# EAGLE design LoRaLo_V20-1 (EAGLE 7.5.0)
RFM95W
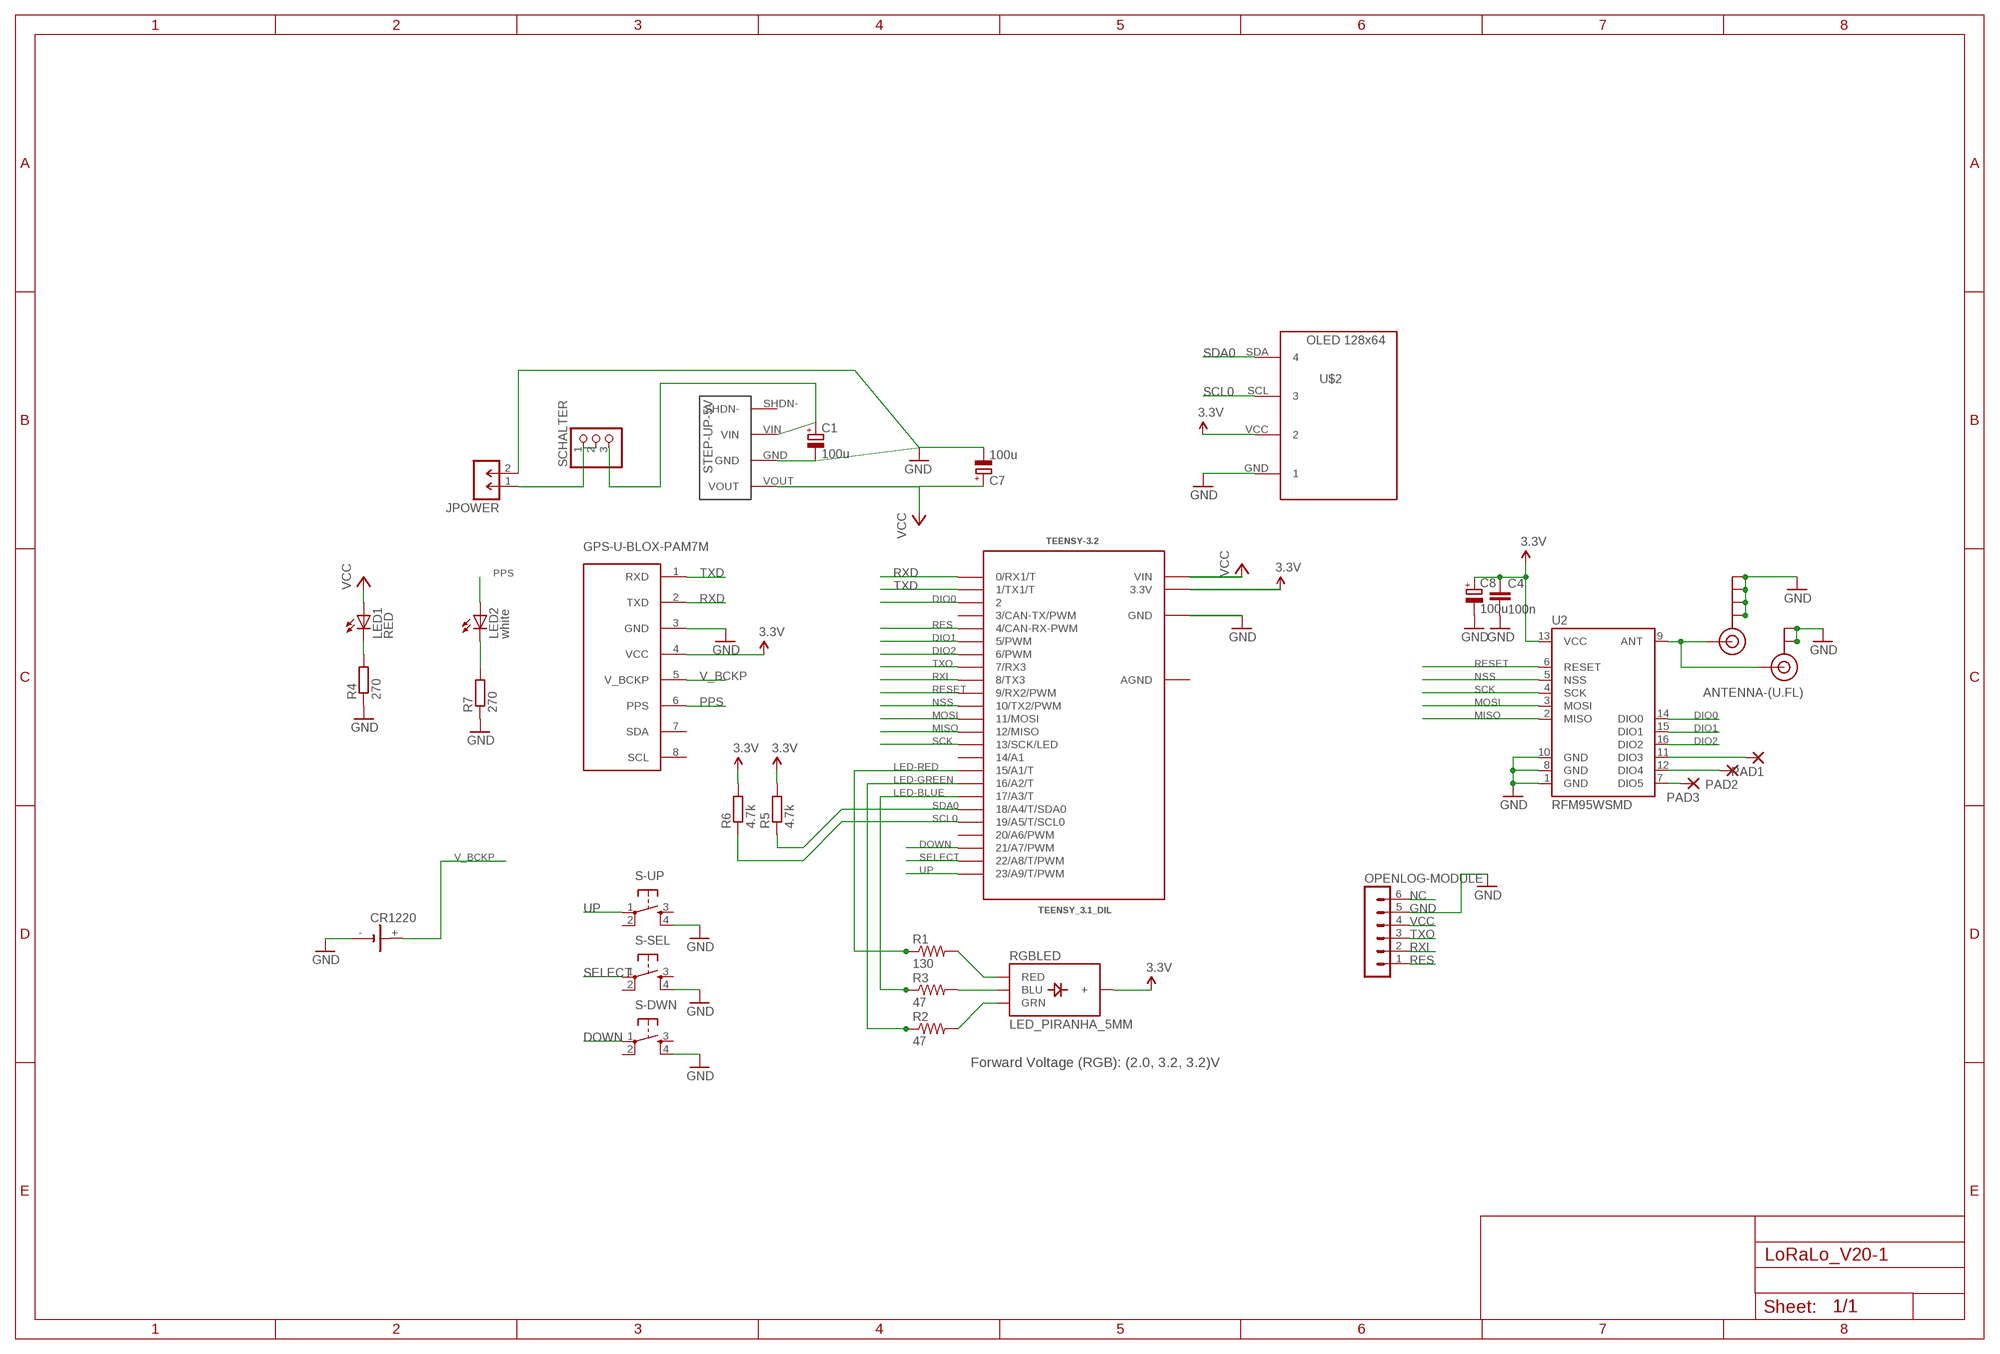
[diagram p0: schematic, sheet 1]

## Parts
ANTENNA-(EDGE-MOUNT)  SMA_EDGE  [SMA-EDGE]
ANTENNA-(U.FL)  U.FL  [U.FL]
C1  100u  CPOL-EUD  [PANASONIC_D]
C4  100n  C-EUC1206  [C1206]
C7  100u  CPOL-EUD  [PANASONIC_D]
C8  100u  CPOL-EUD  [PANASONIC_D]
CR1220  CH291-1220LF  [CH291-1220LF]
GPS-U-BLOX-PAM7M  U-BLOX-PAM-7Q  [U-BLOX-PAM-7Q]
JPOWER  M-1X02-SIP-100-40  [SIP-100-02-40]
LED1  RED  LED1206  [LED-1206]
LED2  white  LED1206  [LED-1206]
OPENLOG-MODULE  MA06-1  [MA06-1]
PAD1  1,6/0,8  [1,6/0,8]
PAD2  1,6/0,8  [1,6/0,8]
PAD3  1,6/0,8  [1,6/0,8]
R1  130  RESISTOR1206  [1206]
R2  47  RESISTOR1206  [1206]
R3  47  RESISTOR1206  [1206]
R4  270  R-EU_M1206  [M1206]
R5  4.7k  R-EU_M1206  [M1206]
R6  4.7k  R-EU_M1206  [M1206]
R7  270  R-EU_M1206  [M1206]
RGBLED  LED_PIRANHA_5MM  [LED_PIRANHA_5MM]
S-DWN  TAC_SWITCHPTH  [TACTILE-PTH]
S-SEL  TAC_SWITCHPTH  [TACTILE-PTH]
S-UP  TAC_SWITCHPTH  [TACTILE-PTH]
SCHALTER  PINHD-1X3  [1X03]
STEP-UP-5V  POLOLU_STEP-UP  [POLOLU_STEP-UP]
TEENSY-3.2  TEENSY_3.1_DIL  [TEENSY3-DIL]
U2  RFM95WSMD  [RFM95W_SMD]
U$2  OLED_128X64  [OLED_128X64]

## Nets
3.3V [power]: C4.1 C8.+ GPS-U-BLOX-PAM7M.4(VCC) R5.2 R6.2 RGBLED.+ TEENSY-3.2.3.3V U2.13(VCC) U$2.VCC
DIO0: TEENSY-3.2.2 U2.14(DIO0)
DIO1: TEENSY-3.2.5(5/PWM) U2.15(DIO1)
DIO2: TEENSY-3.2.6(6/PWM) U2.16(DIO2)
DOWN: S-DWN.1 TEENSY-3.2.21/A7(21/A7/PWM)
GND [power]: ANTENNA-(EDGE-MOUNT).GND@0(GND) ANTENNA-(EDGE-MOUNT).GND@1(GND) ANTENNA-(EDGE-MOUNT).GND@2(GND) ANTENNA-(EDGE-MOUNT).GND@3(GND) ANTENNA-(U.FL).P$1(GND) ANTENNA-(U.FL).P$2(GND) C1.- C4.2 C7.- C8.- CR1220.- GPS-U-BLOX-PAM7M.3(GND) JPOWER.2 OPENLOG-MODULE.5 R4.1 R7.1 S-DWN.4 S-SEL.4 S-UP.4 STEP-UP-5V.GND TEENSY-3.2.GND U2.1(GND) U2.8(GND) U2.10(GND) U$2.GND
LED-BLUE: R3.1 TEENSY-3.2.17/A3(17/A3/T)
LED-GREEN: R2.1 TEENSY-3.2.16/A2(16/A2/T)
LED-RED: R1.1 TEENSY-3.2.15/A1(15/A1/T)
MISO: TEENSY-3.2.12(12/MISO) U2.2(MISO)
MOSI: TEENSY-3.2.11(11/MOSI) U2.3(MOSI)
N$1: R1.2 RGBLED.R(RED)
N$2: PAD1.1(P) U2.11(DIO3)
N$3: R2.2 RGBLED.G(GRN)
N$4 [power]: C1.+ SCHALTER.3 STEP-UP-5V.VIN
N$5: ANTENNA-(EDGE-MOUNT).SIG(SIGNAL) ANTENNA-(U.FL).P$3(SIGNAL) U2.9(ANT)
N$6: PAD2.1(P) U2.12(DIO4)
N$7: PAD3.1(P) U2.7(DIO5)
N$9: R3.2 RGBLED.B(BLU)
N$10: JPOWER.1 SCHALTER.1 SCHALTER.2
N$11: LED2.C R7.2
N$23: LED1.C R4.2
NC: OPENLOG-MODULE.6
NSS: TEENSY-3.2.10(10/TX2/PWM) U2.5(NSS)
PPS: GPS-U-BLOX-PAM7M.6(PPS) LED2.A
RES: OPENLOG-MODULE.1 TEENSY-3.2.4(4/CAN-RX-PWM)
RESET: TEENSY-3.2.9(9/RX2/PWM) U2.6(RESET)
RXD: GPS-U-BLOX-PAM7M.2(TXD) TEENSY-3.2.0(0/RX1/T)
RXI: OPENLOG-MODULE.2 TEENSY-3.2.8(8/TX3)
SCK: TEENSY-3.2.13(13/SCK/LED) U2.4(SCK)
SCL0: R6.1 TEENSY-3.2.19/A5(19/A5/T/SCL0) U$2.SCL
SDA0: R5.1 TEENSY-3.2.18/A4(18/A4/T/SDA0) U$2.SDA
SELECT: S-SEL.1 TEENSY-3.2.22/A8(22/A8/T/PWM)
TXD: GPS-U-BLOX-PAM7M.1(RXD) TEENSY-3.2.1(1/TX1/T)
TXO: OPENLOG-MODULE.3 TEENSY-3.2.7(7/RX3)
UP: S-UP.1 TEENSY-3.2.23/A9(23/A9/T/PWM)
V_BCKP: CR1220.+ GPS-U-BLOX-PAM7M.5(V_BCKP)
VCC [power]: C7.+ LED1.A OPENLOG-MODULE.4 STEP-UP-5V.VOUT TEENSY-3.2.VIN
Unconnected: GPS-U-BLOX-PAM7M.7(SDA) GPS-U-BLOX-PAM7M.8(SCL) S-DWN.2 S-DWN.3 S-SEL.2 S-SEL.3 S-UP.2 S-UP.3 STEP-UP-5V.SHDN- TEENSY-3.2.3(3/CAN-TX/PWM) TEENSY-3.2.14/A0(14/A1) TEENSY-3.2.20/A6(20/A6/PWM)

## Notes on the sheet
- Forward Voltage (RGB): (2.0, 3.2, 3.2)V

## Power pins joined to a net without a drawn wire
AGND: TEENSY-3.2.AGND

## Library data of the parts
ANTENNA-(EDGE-MOUNT) = SparkFun-Connectors:SMA_EDGE: SMA Antenna Connector End launch SMA connector. The paste layer has been removed so that the connector can be hand soldered onto the board after reflow.
ANTENNA-(U.FL) = SparkFun-Connectors:U.FL: SMD antenna connector- WRL-09144; PROD_ID: CONN-09193
C1 C7 C8 = rcl:CPOL-EU: POLARIZED CAPACITOR, European symbol
C4 = resistor:C-EU: CAPACITOR, European symbol
CR1220 = battery_mod:CH291-1220LF: Battery Holder, SMT, 12mm multicomp PART NO. CH291-1220LF Source: Data sheet <http://www.farnell.com/datasheets/1505860.pdf>
GPS-U-BLOX-PAM7M = u-blox:U-BLOX-PAM-7Q
JPOWER = con-headers-jp:M-1X02-: MALE HEADER
LED1 LED2 = SparkFun-LED:LED: LEDs Standard schematic elements and footprints for 5mm, 3mm, 1206, and 0603 sized LEDs. 5mm - Spark Fun Electronics SKU : COM-00529 (and others)
OPENLOG-MODULE = con-lstb:MA06-1: PIN HEADER; OC_FARNELL: unknown; OC_NEWARK: unknown
PAD1-PAD3 = wirepad:1,6/0,8: THROUGH-HOLE PAD
R1-R3 = SparkFun-Passives:RESISTOR: Resistor Basic schematic elements and footprints for 0603, 1206, and PTH resistors.
R4-R7 = rcl:R-EU_: RESISTOR, European symbol
RGBLED = SparkFun-LED_mod:LED_PIRANHA_5MM: High-brightness RGB through-hole LED, similar to that used in the Shiftbrite
S-DWN S-SEL S-UP = SparkFun-Retired:TAC_SWITCH: Momentary Switch Button commonly used for reset or general input. Spark Fun Electronics SKU : COM-00097 SMT- SWCH-08247
SCHALTER = pinhead:PINHD-1X3: PIN HEADER
STEP-UP-5V = Pololu_Step-Up:POLOLU_STEP-UP
TEENSY-3.2 = Teensy_3_and_LC_Series_Boards_v1.1:TEENSY_3.1_DIL: Teensy 3.1 or 3.2 in a DIL Layout.
U2 = misiek:RFM95W
U$2 = OLED:OLED_128X64

## Net classes
0 default: width 0.12 mm
1 power: width 0.762 mm, drill 0.457 mm, clearance 0.457 mm

## Board
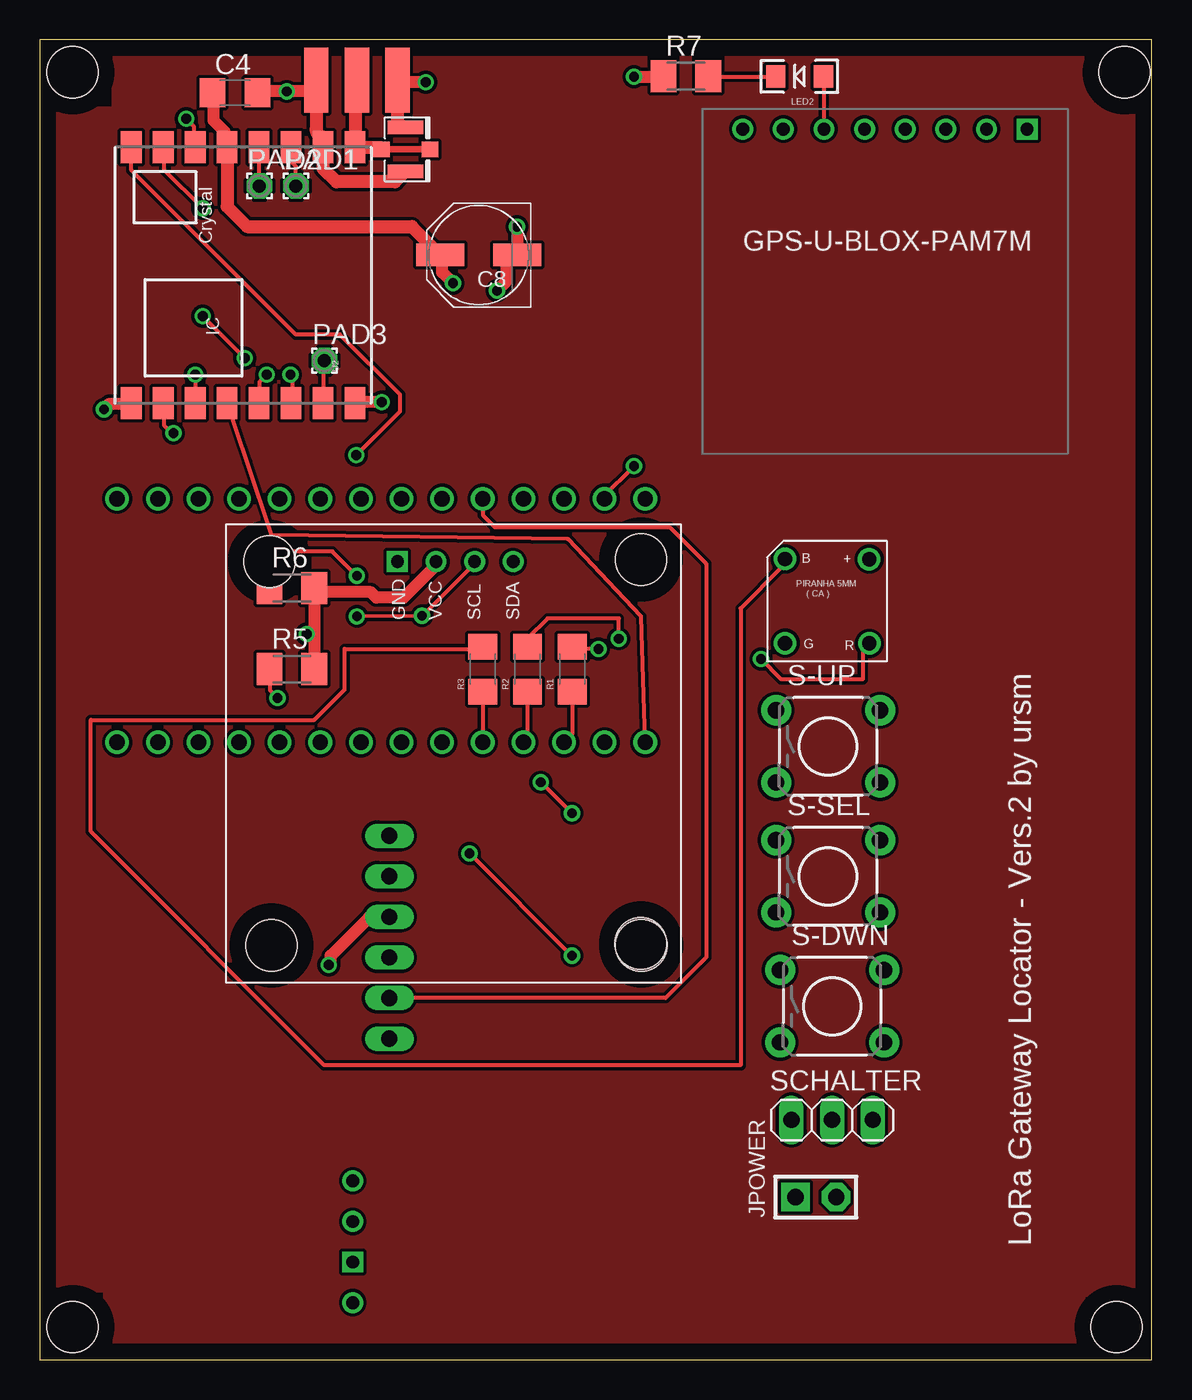
[diagram p1: board, top side]
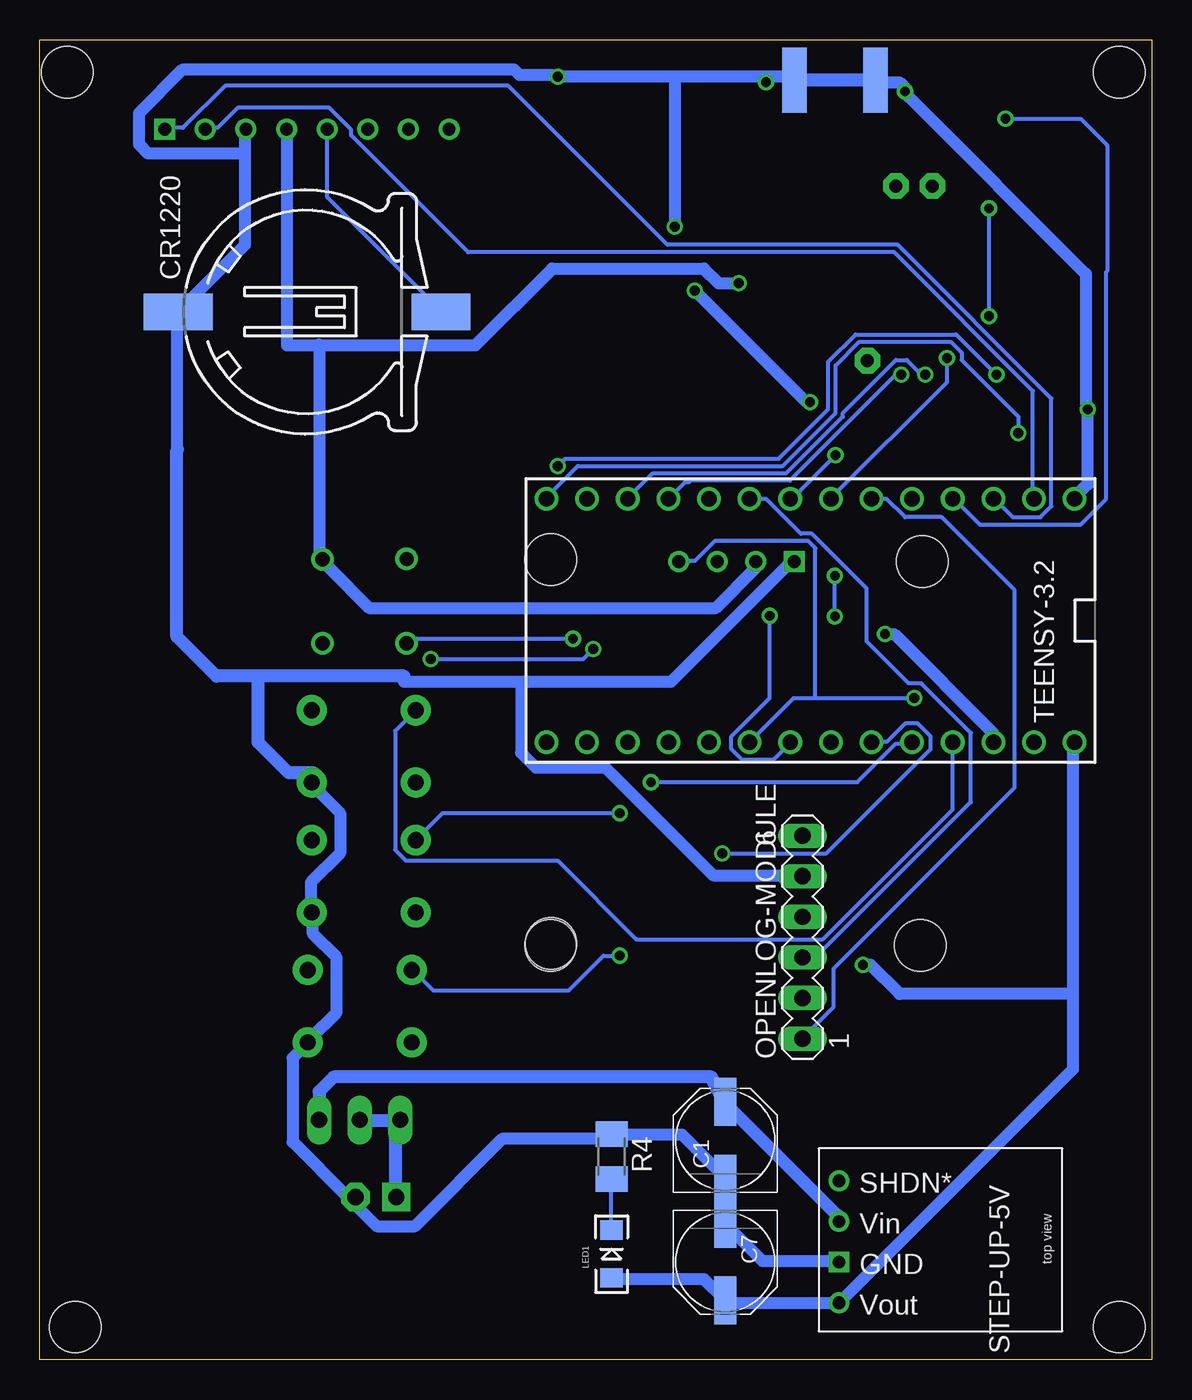
[diagram p2: board, bottom side, seen from below]

Size 69.52 x 82.54 mm. Coordinates in mm from the lower left corner, seen from the top.
Outline: 0,0 69.52,0 69.52,82.54 0,82.54 0,0
Copper layers (1*16): Top 0.035mm / dielectric 1.5mm / Bottom 0.035mm
Design rules "default": minimum track width 10mil, minimum drill 24mil, track to track 8mil, track to pad 8mil, pad to pad 8mil, via to via 8mil, smd to smd 8mil, copper to edge 40mil, drill to drill 8mil, minimum pad ring 10mil, minimum via ring 8mil, stop-mask expansion 4mil, vias tented up to drill 0mil, thermal gap 10mil
Holes 3.2 mm at 2.03,80.52 67.82,80.52 14.48,25.91 67.31,2.03 37.59,25.91 2.03,2.03

### Footprints (pad centres in the part's own frame; a part is rotated, then mirrored left to right if it is on the bottom)
SMA-EDGE = smd 1.524 x 4.064: GND@0 0,0; GND@1 5.08,0; SIG 2.54,0 | smd 1.524 x 4.064 bottom: GND@2 0,0; GND@3 5.08,0
U.FL = smd 2.2 x 0.85: P$1 0,1.375; P$2 0,-1.375 | smd 1.05 x 1: P$3 1.525,0; P$4 -1.525,0
PANASONIC_D = smd 3 x 1.4: + 2.4,0; - -2.4,0
C1206 = smd 1.6 x 1.8: 1 -1.4,0; 2 1.4,0
CH291-1220LF = smd 2.3 x 3.66: + 0,-2.296 | smd 2.3 x 4.3: - 0,14.146
U-BLOX-PAM-7Q = drill 0.8 square: 1 3.81,-2.54 | drill 0.8: 2 1.27,-2.54; 3 -1.27,-2.54; 4 -3.81,-2.54; 5 -6.35,-2.54; 6 -8.89,-2.54; 7 -11.43,-2.54; 8 -13.97,-2.54
SIP-100-02-40 = drill 1.016 pad 1.778 square: 1 -1.27,0 | drill 1.016 pad 1.778 octagon: 2 1.27,0
LED-1206 = smd 1.2 x 1.4: A -1.5,0; C 1.5,0
MA06-1 = drill 1.016 long: 1 -6.35,0; 2 -3.81,0; 3 -1.27,0; 4 1.27,0; 5 3.81,0; 6 6.35,0
1,6/0,8 = drill 0.813 pad 1.6 octagon: 1 0,0
1206 = smd 1.6 x 1.8: 1 -1.4,0; 2 1.4,0
M1206 = smd 1.6 x 2: 1 -1.4,0; 2 1.4,0
LED_PIRANHA_5MM = drill 0.9: + 2.575,2.562; B -2.688,2.574; G -2.684,-2.684; R 2.579,-2.696
TACTILE-PTH = drill 1.016 pad 1.88: 1 -3.251,2.261; 2 3.251,2.261; 3 -3.251,-2.261; 4 3.251,-2.261
1X03 = drill 1.016 long: 1 -2.54,0; 2 0,0; 3 2.54,0
POLOLU_STEP-UP = drill 0.8 square: GND 7.112,1.27 | drill 0.8: SHDN- 2.032,1.27; VIN 4.572,1.27; VOUT 9.652,1.27
TEENSY3-DIL = drill 0.965: 0 -7.62,13.97; 1 -7.62,11.43; 2 -7.62,8.89; 3 -7.62,6.35; 3.3V 7.62,11.43; 4 -7.62,3.81; 5 -7.62,1.27; 6 -7.62,-1.27; 7 -7.62,-3.81; 8 -7.62,-6.35; 9 -7.62,-8.89; 10 -7.62,-11.43; 11 -7.62,-13.97; 12 -7.62,-16.51; 13 7.62,-16.51; 14/A0 7.62,-13.97; 15/A1 7.62,-11.43; 16/A2 7.62,-8.89; 17/A3 7.62,-6.35; 18/A4 7.62,-3.81; 19/A5 7.62,-1.27; 20/A6 7.62,1.27; 21/A7 7.62,3.81; 22/A8 7.62,6.35; 23/A9 7.62,8.89; AGND 7.62,13.97; GND -7.62,16.51; VIN 7.62,16.51
RFM95W_SMD = smd 2 x 1.3: 1 -8,7; 2 -8,5; 3 -8,3; 4 -8,1; 5 -8,-1; 6 -8,-3; 7 -8,-5; 8 -8,-7; 9 8,-7; 10 8,-5; 11 8,-3; 12 8,-1; 13 8,1; 14 8,3; 15 8,5; 16 8,7
OLED_128X64 = drill 0.8 square: GND -1.778,10.541 | drill 0.8: SCL 3.044,10.54; SDA 5.455,10.541; VCC 0.633,10.541 | hole 3.2: -9.776,10.539; 13.444,10.666; 13.441,-13.345; -9.65,-13.473

### Placement (x,y rotation side)
ANTENNA-(EDGE-MOUNT)  17.27,80.01 0 top
ANTENNA-(U.FL)  22.86,75.69 0 top
C1  26.67,13.72 90 bottom
C4  12.19,79.25 0 top
C7  26.67,6.1 270 bottom
C8  27.43,69.09 180 top
CR1220  46.74,65.53 90 bottom
GPS-U-BLOX-PAM7M  57.91,79.5 0 top
JPOWER  48.51,10.16 0 top
LED1  33.78,6.6 90 bottom
LED2  47.5,80.26 180 top
OPENLOG-MODULE  21.84,26.42 90 bottom
PAD1  16,73.41 0 top
PAD2  13.72,73.41 0 top
PAD3  17.78,62.48 0 top
R1  33.27,43.18 90 top
R2  30.48,43.18 90 top
R3  27.69,43.18 90 top
R4  33.78,12.7 270 bottom
R5  15.75,43.18 0 top
R6  15.75,48.26 0 top
R7  40.39,80.26 0 top
RGBLED  49.28,47.5 0 top
S-DWN  49.53,22.1 0 top
S-SEL  49.28,30.23 0 top
S-UP  49.28,38.35 0 top
SCHALTER  49.53,14.99 0 top
STEP-UP-5V  20.83,13.21 270 bottom
TEENSY-3.2  21.34,46.23 270 bottom
U2  12.7,67.82 90 top
U$2  24.13,39.37 0 top

### Tracks (layer width: path | path; a pad name or v marks a point on that pad's centre or on a via)
3.3V  (via drill 0.61)
  Top 0.762: 17.14,45.38 17.14,48.23 R6.2 17.49,48.01 20.69,48.01 21.03,47.66 22.75,47.66 24.69,49.61 24.69,49.84 U$2.VCC | 17.14,45.38 17.14,43.2 R5.2 | v16.69,45.38 17.14,45.38 | C4.1 10.86,79.21 10.86,77.5 11.54,76.81 11.54,76.01 11.66,75.89 U2.13 | v25.83,67.32 25.15,68.01 25.15,69.04 C8.+
  Top 0.813: U2.13 11.7,72.12 12.95,70.87 23.25,70.87 C8.+
  Bottom 0.762: v16.69,45.38 16.12,45.38 9.94,39.2 9.94,38.63 TEENSY-3.2.3.3V | 24.8,49.49 24.8,49.84 U$2.VCC 24.77,49.53 27.3,46.99 48.9,46.99 51.44,49.53 RGBLED.+ 52.07,50.16 52.07,63.44 | GPS-U-BLOX-PAM7M.4 54.06,76.92 54.06,63.44 52.07,63.44 | v25.83,67.32 27.09,67.32 28,68.24 37.49,68.24 42.29,63.44 52.07,63.44 | 52.07,63.5 52.07,63.44
DIO0  (via drill 0.61)
  Top 0.254: v9.14,77.61 9.6,77.15 9.6,75.89 U2.14
  Bottom 0.254: TEENSY-3.2.2 12.34,53.84 10.74,52.23 4.46,52.23 2.86,53.84 2.86,68.01 2.79,68.07 2.79,75.95 4.46,77.61 v9.14,77.61
DIO1  (via drill 0.61)
  Top 0.254: v10.17,72.01 7.77,74.41 7.77,75.78 U2.15 | v12.8,62.64 v10.17,65.27
  Bottom 0.254: v10.17,65.27 v10.17,72.01 | v12.8,62.64 12.8,61.15 20,53.95 TEENSY-3.2.5
DIO2  (via drill 0.61)
  Top 0.254: v19.77,56.58 22.52,59.32 22.52,60.35 18.75,64.12 16,64.12 5.71,74.41 5.71,75.78 U2.16
  Bottom 0.254: v19.77,56.58 22.52,53.84 TEENSY-3.2.6
DOWN  (via drill 0.61)
  Top 0.254: v33.26,25.26 v26.86,31.66
  Bottom 0.254: v26.86,31.66 20.34,31.66 13.83,38.18 13.83,38.98 14.63,39.78 15.43,39.78 16.57,38.63 17.49,38.63 TEENSY-3.2.21/A7 | v33.26,25.26 34.29,25.26 36.46,23.09 44.92,23.09 46.18,24.35 S-DWN.1
GND  (via drill 0.61)
  Top 0.762: v21.37,59.89 19.77,59.89 U2.8 | v28.57,66.86 29.15,67.44 29.15,68.69 29.49,69.04 29.72,69.04 C8.- 29.83,69.49 v29.83,70.87 | v4,59.44 4.34,59.78 5.6,59.78 U2.1 | C4.2 13.6,79.32 v15.43,79.32 16.92,79.32 ANTENNA-(EDGE-MOUNT).GND@0 | v37.15,80.24 38.98,80.24 R7.1 | v24.12,79.9 22.75,79.9 ANTENNA-(EDGE-MOUNT).GND@1
  Top 0.813: ANTENNA-(EDGE-MOUNT).GND@0 17.27,76.96 arc90 17.78,76.45 17.78,75.9 arc-90 U2.10 17.7,74.5 18.54,73.66 22.2,73.66 ANTENNA-(U.FL).P$2 | ANTENNA-(EDGE-MOUNT).GND@1 22.35,77.58 arc90 ANTENNA-(U.FL).P$1
  Bottom 0.762: v21.37,59.89 21.6,59.89 v28.57,66.86 | TEENSY-3.2.GND 4.8,53.95 4,54.75 v4,59.44 4.12,59.78 4.12,67.89 15.2,78.98 v15.43,79.32 15.32,79.32 15.32,79.44 15.77,79.9 16.92,79.9 ANTENNA-(EDGE-MOUNT).GND@0 | 24.12,80.24 22.63,80.24 ANTENNA-(EDGE-MOUNT).GND@1 | 24.12,80.24 29.83,80.24 | 29.83,80.24 v37.15,80.24 37.49,80.35 39.55,80.35 39.89,80.7 60.58,80.7 63.32,77.95 63.32,76.01 62.75,75.44 56.69,75.44 | v24.12,79.9 24.12,80.24 | 29.83,80.24 v29.83,70.87 | STEP-UP-5V.GND 19.66,6.17 24.35,6.17 26.63,8.46 C7.- 26.75,8.8 26.75,10.97 C1.- 26.75,11.43 29.38,14.06 33.72,14.06 R4.1 34.06,13.83 40.58,13.83 46.06,8.34 48.46,8.34 49.61,9.49 49.61,9.83 JPOWER.2 49.84,10.17 50.29,10.17 53.72,13.6 53.72,18.86 52.81,19.77 S-DWN.4 52.58,20.12 50.98,21.72 50.98,25.15 52.46,26.63 52.46,27.89 S-SEL.4 52.58,28.35 52.58,29.83 50.75,31.66 50.75,34.18 52.35,35.78 S-UP.4 52.46,36.12 52.46,36.69 | 56.69,75.44 56.69,69.72 60.81,65.61 CR1220.- 60.92,65.15 60.92,56.92 | 56.69,75.44 56.69,76.92 GPS-U-BLOX-PAM7M.3 | 39.43,42.41 46.75,42.41 46.75,42.75 | 39.43,42.41 30.06,42.41 22.63,49.84 22.4,49.84 U$2.GND | 39.43,42.41 39.43,37.95 38.52,37.03 34.18,37.03 27.43,30.29 21.95,30.29 OPENLOG-MODULE.5
  Bottom 0.813: ANTENNA-(EDGE-MOUNT).GND@0 ANTENNA-(EDGE-MOUNT).GND@1 | 46.75,42.75 55.88,42.75 | 55.88,42.75 58.5,42.75 60.96,45.21 60.96,56.88 60.92,56.92 | 52.46,36.69 53.96,36.69 55.88,38.61 55.88,42.75
LED-BLUE
  Top 0.254: R3.1 TEENSY-3.2.17/A3
LED-GREEN
  Top 0.254: R2.1 30.48,38.86 TEENSY-3.2.16/A2
LED-RED
  Top 0.254: R1.1 33.27,39.12 TEENSY-3.2.15/A1
MISO  (via drill 0.61)
  Top 0.254: v8.34,57.95 8.23,57.95 7.77,58.41 7.77,59.78 U2.2
  Bottom 0.254: v8.34,57.95 8.34,58.98 11.89,62.52 11.89,62.98 12.57,63.66 18.29,63.66 19.77,62.18 19.77,59.21 23.09,55.89 35.89,55.89 37.83,53.95 TEENSY-3.2.12
MOSI  (via drill 0.61)
  Top 0.254: v9.72,61.61 9.72,59.89 U2.3 | v37.15,55.89 35.2,53.95 TEENSY-3.2.11
  Bottom 0.254: v9.72,61.61 12.23,64.12 18.52,64.12 20.23,62.41 20.23,59.44 23.32,56.35 36.69,56.35 v37.15,55.89
N$1  (via drill 0.61)
  Top 0.254: v34.92,44.45 33.66,44.45 R1.2 | v45.09,43.81 46.35,42.55 51.44,42.55 51.44,44.45 RGBLED.R
  Bottom 0.254: v34.92,44.45 35.56,43.81 v45.09,43.81
N$2
  Top 0.254: PAD1.1 16,74.64 15.77,74.87 15.77,75.78 U2.11
N$3  (via drill 0.61)
  Top 0.254: v36.2,45.09 36.2,46.35 31.75,46.35 30.48,45.09 R2.2
  Bottom 0.254: v36.2,45.09 46.35,45.09 RGBLED.G
N$4
  Bottom 0.254: 19.66,9.03 19.66,8.69 STEP-UP-5V.VIN | 26.63,16 C1.+ 26.75,16.12 | 51.78,15.09 52.01,15.09 SCHALTER.3
  Bottom 0.813: 26.63,16 19.66,9.03 | 26.75,16.12 27.55,17.68 51.16,17.68 52.07,16.76 SCHALTER.3
N$5
  Top 0.406: 21.34,75.69 ANTENNA-(U.FL).P$3
  Top 0.813: 21.34,75.69 21.34,75.82 U2.9 19.7,80.01 ANTENNA-(EDGE-MOUNT).SIG
N$6
  Top 0.254: PAD2.1 13.72,75.78 U2.12
N$7
  Top 0.254: U2.7 17.72,59.89 17.72,62.41 PAD3.1
N$8
  pour Top (hatched): 4.57,82.04 4.57,78.23 0.51,78.23 0.51,4.32 4.06,4.32 4.06,0.51 65.28,0.51 65.28,4.06 68.83,4.06 68.83,78.49 65.79,78.49 65.79,82.04
N$9
  Top 0.254: R3.2 27.3,44.45 19.05,44.45 19.05,41.91 17.14,40.01 3.17,40.01 3.17,33.02 17.78,18.41 43.81,18.41 43.81,46.99 46.35,49.53 RGBLED.B
N$10
  Bottom 0.254: 47.09,14.97 SCHALTER.1 47.32,14.86 | 49.49,14.97 SCHALTER.2 | 47.32,10.17 JPOWER.1
  Bottom 0.813: 49.49,14.97 47.09,14.97 | 47.32,14.86 47.32,10.17
N$11
  Top 0.254: LED2.C 45.95,80.24 41.83,80.24 R7.2
N$12
  pour Top: 4.57,82.04 4.57,78.23 0.51,78.23 0.51,4.32 4.06,4.32 4.06,0.51 65.28,0.51 65.28,4.06 68.83,4.06 68.83,78.49 65.79,78.49 65.79,82.04
N$23
  Bottom 0.254: LED1.C 33.83,8.12 33.83,11.2 R4.2
NSS  (via drill 0.61)
  Top 0.254: v14.17,61.61 13.72,61.15 13.72,59.89 U2.5
  Bottom 0.254: v14.17,61.61 14.4,61.61 15.32,62.52 16,62.52 19.32,59.21 19.32,58.98 22.86,55.44 31.2,55.44 32.69,53.95 TEENSY-3.2.10
PPS
  Top 0.254: LED2.A 49.02,80.24 GPS-U-BLOX-PAM7M.6
RES
  Bottom 0.254: TEENSY-3.2.4 17.49,53.84 16.57,53.84 15.43,52.69 13.14,52.69 8.57,48.12 8.57,35.78 19.89,24.46 19.89,22.06 21.83,20.12 OPENLOG-MODULE.1
RESET  (via drill 0.61)
  Top 0.254: v15.66,61.61 15.77,61.49 15.77,59.89 U2.6
  Bottom 0.254: v15.66,61.61 16,61.61 22.63,54.98 28.84,54.98 28.96,54.86 29.21,54.86 TEENSY-3.2.9
RXD
  Bottom 0.254: GPS-U-BLOX-PAM7M.2 59.09,77.04 58.41,77.04 57.15,78.3 51.44,78.3 50.06,76.92 50.06,76.58 42.75,69.27 16.12,69.27 7.43,60.58 7.43,53.95 TEENSY-3.2.0
RXI
  Top 0.254: TEENSY-3.2.8 27.69,52.83 28.45,52.07 39.37,52.07 41.66,49.78 41.66,25.15 39.12,22.61 OPENLOG-MODULE.2
SCK
  Top 0.254: TEENSY-3.2.13 37.59,46.48 33.02,51.31 14.48,51.56 12.95,56.13 U2.4
SCL0  (via drill 0.6, 0.61)
  Top 0.254: U$2.SCL 27.09,49.84 26.86,49.61 26.86,49.49 v23.89,46.52 v19.81,46.48 | v19.81,49.02 18.29,50.55 15.24,50.55 14.48,49.78 14.48,48.39 R6.1
  Bottom 0.254: v23.89,46.52 23.89,41.38 26.29,38.98 26.29,38.18 25.6,37.49 23.66,37.49 22.63,38.52 TEENSY-3.2.19/A5 | v19.81,46.48 v19.81,49.02
SDA0  (via drill 0.61)
  Top 0.254: v14.86,41.38 14.4,41.83 14.4,43.09 R5.1
  Bottom 0.254: 21.03,41.38 22.4,41.38 25.15,38.63 TEENSY-3.2.18/A4 | 21.03,41.38 v14.86,41.38 | 21.03,41.38 21.03,50.75 21.49,51.21 27.32,51.21 28.57,49.95 29.49,49.95 U$2.SDA
SELECT  (via drill 0.61)
  Top 0.254: v33.26,34.18 v31.32,36.12
  Bottom 0.254: v31.32,36.12 18.4,36.12 16,38.52 15.09,38.52 TEENSY-3.2.22/A8 | v33.26,34.18 44.35,34.18 45.95,32.58 S-SEL.1
TXD
  Bottom 0.254: GPS-U-BLOX-PAM7M.1 61.72,77.04 60.58,77.04 57.95,79.67 40.23,79.67 30.29,69.72 15.89,69.72 6.29,60.12 6.29,53.38 6.97,52.69 8.69,52.69 9.83,53.84 TEENSY-3.2.1
TXO
  Bottom 0.254: OPENLOG-MODULE.3 21.03,25.15 11.32,34.86 11.32,39.2 14.4,42.29 15.2,42.29 17.83,44.92 17.83,48.23 21.26,51.66 21.95,51.66 24.12,53.84 25.15,53.84 TEENSY-3.2.7
UP
  Bottom 0.254: S-UP.1 47.32,39.32 47.32,31.89 46.63,31.2 37.15,31.2 32.23,26.29 20.57,26.29 12.46,34.4 12.46,38.52 TEENSY-3.2.23/A9
V_BCKP
  Bottom 0.254: GPS-U-BLOX-PAM7M.5 51.55,76.92 51.55,72.69 44.46,65.61 CR1220.+
VCC  (via drill 0.61)
  Top 0.762: v18.06,24.69 18.17,24.8 18.17,25.26 20.57,27.66 21.83,27.66 OPENLOG-MODULE.4
  Bottom 0.762: LED1.A 33.72,5.03 28,5.03 26.75,3.77 C7.+ 26.29,3.54 19.66,3.54 STEP-UP-5V.VOUT 19.32,3.77 4.92,18.17 4.92,22.86 | 4.92,22.86 4.92,38.52 TEENSY-3.2.VIN | v18.06,24.69 17.6,24.69 15.77,22.86 4.92,22.86

### Text on the board
tNames: LoRa Gateway Locator - Vers.2 by ursm
Measures: PPS | Vin | GND